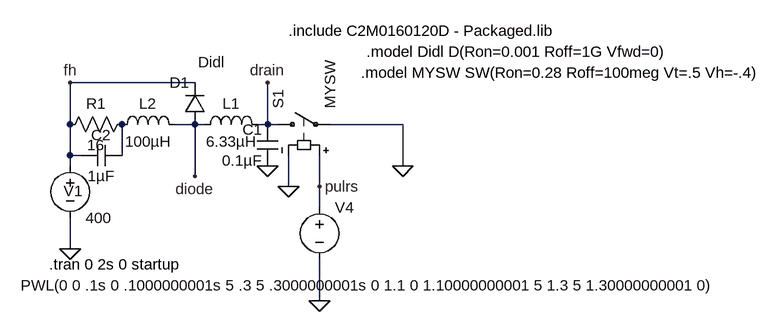
[diagram p0: schematic zvs3.asc]
zvs3.asc, the LTspice schematic file:
Version 4
SHEET 1 2400 680
WIRE 208 32 16 32
WIRE 16 96 16 32
WIRE 208 96 176 96
WIRE 224 96 208 96
WIRE 320 96 320 32
WIRE 320 96 304 96
WIRE 336 96 320 96
WIRE 528 96 416 96
WIRE 16 144 16 96
WIRE 32 144 16 144
WIRE 96 144 96 96
WIRE 16 160 16 144
WIRE 528 160 528 96
WIRE 208 176 208 96
WIRE 352 192 352 144
WIRE 400 192 400 144
WIRE 400 224 400 192
WIRE 16 288 16 240
WIRE 400 368 400 304
FLAG 16 288 0
FLAG 352 192 0
FLAG 400 368 0
FLAG 528 160 0
FLAG 320 160 0
FLAG 400 192 pulrs
FLAG 16 32 fh
FLAG 320 32 drain
FLAG 208 176 diode
SYMBOL voltage 16 144 R0
WINDOW 123 0 0 Left 2
WINDOW 39 24 132 Left 2
WINDOW 0 -10 55 Left 2
SYMATTR InstName V1
SYMATTR Value 400
SYMBOL sw 320 96 R270
SYMATTR InstName S1
SYMATTR Value MYSW
SYMBOL res 112 80 R90
WINDOW 0 0 56 VBottom 2
WINDOW 3 32 56 VTop 2
SYMATTR InstName R1
SYMATTR Value 16
SYMBOL cap 336 160 R180
WINDOW 0 24 56 Left 2
WINDOW 3 24 8 Left 2
SYMATTR InstName C1
SYMATTR Value 0.1µF
SYMBOL ind 208 112 R270
WINDOW 0 32 56 VTop 2
WINDOW 3 5 56 VBottom 2
SYMATTR InstName L1
SYMATTR Value 6.33µH
SYMBOL ind 80 112 R270
WINDOW 0 32 56 VTop 2
WINDOW 3 5 56 VBottom 2
SYMATTR InstName L2
SYMATTR Value 100µH
SYMBOL diode 224 96 R180
WINDOW 0 24 64 Left 2
WINDOW 3 -30 96 Left 2
SYMATTR InstName D1
SYMATTR Value Didl
SYMBOL voltage 400 208 R0
WINDOW 123 0 0 Left 2
WINDOW 39 24 132 Left 2
WINDOW 3 -460 136 Left 2
SYMATTR Value PWL(0 0 .1s 0 .1000000001s 5 .3 5 .3000000001s 0 1.1 0 1.10000000001 5 1.3 5 1.30000000001 0)
SYMATTR InstName V4
SYMBOL cap 96 128 R90
WINDOW 0 0 32 VBottom 2
WINDOW 3 32 32 VTop 2
SYMATTR InstName C2
SYMATTR Value 1µF
TEXT -16 312 Left 2 !.tran 0 2s 0 startup
TEXT 464 16 Left 2 !.model MYSW SW(Ron=0.28 Roff=100meg Vt=.5 Vh=-.4)
TEXT 352 -48 Left 2 !.include C2M0160120D - Packaged.lib
TEXT 472 -16 Left 2 !.model Didl D(Ron=0.001 Roff=1G Vfwd=0)

The netlist it stands for:
* zvs3.asc
V1 fh 0 400
S1 drain 0 pulrs 0 MYSW
R1 N001 fh 16
C1 0 drain 0.1µF
L1 diode drain 6.33µH
L2 N001 diode 100µH
D1 diode fh Didl
V4 pulrs 0 PWL(0 0 .1s 0 .1000000001s 5 .3 5 .3000000001s 0 1.1 0 1.10000000001 5 1.3 5 1.30000000001 0)
C2 N001 fh 1µF
.model D D
.lib standard.dio
.tran 0 2s 0 startup
.model MYSW SW(Ron=0.28 Roff=100meg Vt=.5 Vh=-.4)
.include C2M0160120D - Packaged.lib
.model Didl D(Ron=0.001 Roff=1G Vfwd=0)
.backanno
.end